# EasyEDA Pro project ProDoc_Esp32c3_2025-05-25.epro

# Board Esp32c3
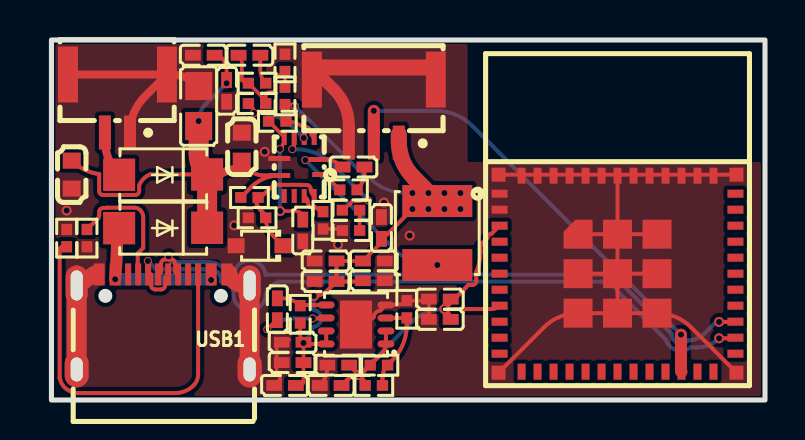
[diagram p0: board, top side]
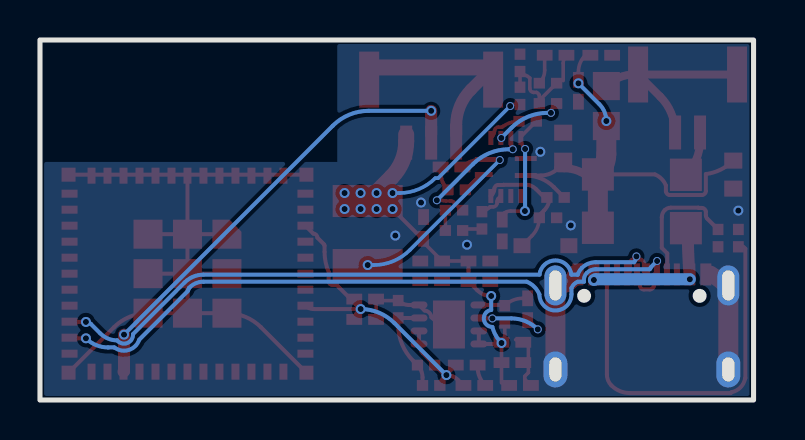
[diagram p1: board, bottom side, seen from below]

Outline 35.7 x 18 mm; copper layers: Top Layer, Bottom Layer. Coordinates in mm from the lower left corner of the outline.
Outline path: rectangle 0,18 35.7,0
Stack: Top Layer 0.035mm / Dielectric1 1.51mm FR4 er 4.5 / Bottom Layer 0.035mm

## Design rules (mm)
template: 自定义配置
spacing copperThickness1oz: track to track 0.102, other pairs 0.152 to 0.3
spacing copperThickness2oz (default): track to track 0.1, other pairs 0.1 to 0.3
track width copperThickness1oz: min 0.1, default 0.254, max 2.54
track width copperThickness2oz (default): min 0.1, default 0.254, max 2.54
differential pair differentialPair (default): width min 0.127, default 0.254, max 2.54; gap min 0.152, default 0.152
via viaSize (default): diameter min 0.5, default 0.61, max 10; hole min 0.3, default 0.305, max 6.3

## Placement (name value [footprint] x y rotation side)
C1  10uF  [C0603]  1.02 11.27 270 top
C2  22uF  [C0805]  7.37 14.7 90 top
C3  -  [C0402]  7.62 17.24 0 top
C3#2  -  [C0402]  8.76 15.46 270 top
C4  10uF  [C0603]  9.53 12.67 90 top
C5  1uF  [C0402]  12.57 8.48 90 top
C6  100nF  [C0402]  15.11 11.65 0 top
C7  100nF  [C0402]  9.91 17.24 0 top
C8  22uF  [C0402]  16.51 8.6 90 top
C9  22uF  [C0402]  13.72 6.95 0 top
C10  22uF  [C0402]  13.72 5.93 0 top
C11  22uF  [C0402]  16.13 6.95 0 top
C12  22uF  [C0402]  16.13 5.97 0 top
C13  1nF  [C0402]  11.3 4.54 90 top
C14  4.7uF  [C0402]  12.06 2.89 0 top
C15  2.2uF  [C0402]  12.06 1.87 0 top
C16  2.2uF  [C0402]  11.68 0.73 0 top
C17  4.7uF  [C0402]  19.43 5.05 0 top
C18  4.7uF  [C0402]  19.43 4.03 0 top
C19  100nF  [C0402]  13.97 0.73 0 top
C20  100nF  [C0402]  14.35 1.74 0 top
CN1  WAFER-GH1.25-2PWB  [CONN-TH_2P-P1.25_XUNPU_WAFER-GH1.25-2PWB]  3.3 14.83 180 top
CN3  WAFER-GH1.25-3PWB  [CONN-TH_3P-P1.25_GH1.25]  16.13 14.44 180 top
D1  SS34  [SMA_L4.3-W2.6-LS5.0-FD]  5.59 8.6 0 top
D2  SS34  [SMA_L4.3-W2.6-LS5.0-FD]  5.59 11.27 0 top
D3  BZT52C5V1S-7-F  [SOD-323_L1.8-W1.3-LS2.5-RD]  10.41 7.71 180 top
L1  15uH  [IND-SMD_L4.0-W4.0]  19.3 8.35 90 top
R1  5.1kΩ  [R0402]  0.76 8.09 90 top
R2  5.1kΩ  [R0402]  1.78 8.09 90 top
R3  -  [R0402]  9.91 10.13 0 top
R3#2  -  [R0402]  11.3 13.94 0 top
R4  20kΩ  [R0402]  10.29 9.11 0 top
R5  0Ω  [R0402]  14.86 10.51 0 top
R6  20kΩ  [R0402]  10.29 14.83 0 top
R7  41.2kΩ  [R0402]  10.29 15.84 0 top
R8  7.68kΩ  [R0402]  11.68 16.86 90 top
R9  10Ω  [R0402]  11.68 15.21 270 top
R10  10Ω  [R0402]  14.99 9.49 0 top
R11  76.8kΩ  [R0402]  14.99 8.48 0 top
R12  100kΩ  [R0402]  13.59 8.98 90 top
R13  100kΩ  [R0402]  12.45 4.28 90 top
R14  10kΩ  [R0402]  17.78 4.54 90 top
R15  62kΩ  [R0402]  16.38 1.74 0 top
R16  62kΩ  [R0402]  16.13 0.73 0 top
U1  MP4573GQBE-Z  [QFN-12_L3.0-W2.5-P0.5_MPQ4572]  12.45 11.65 180 top
U2  -  [TDFN-8_L3.0-W3.0-P0.65-BL-EP]  15.24 3.78 90 top
U2#2  -  [WIFIM-SMD_ESP32-C3-MINI-1]  28.32 6.32 0 top
USB1  TYPE-C 16PIN 2MD(073)  [USB-C-SMD_TYPE-C-6PIN-2MD-073]  5.59 3.9 0 top

## Footprints (pads in the part's own frame, mm; a bottom-side part is the same pattern mirrored in y, then rotated)
C0402
  rect 0.79x0.54 smd: 1(-0.545,0) 2(0.545,0)
C0603
  rect 0.8x0.9 smd: 1(-0.7,0) 2(0.7,0)
C0805
  rect 1.41x1.35 smd: 1(-1,0) 2(1,0)
CONN-TH_2P-P1.25_XUNPU_WAFER-GH1.25-2PWB
  rect 0.6x1.7 smd: 1(-0.625,1.45) 2(0.625,1.45)
  rect 1x2.8 smd: 3(-2.475,-1.45) 4(2.475,-1.45)
CONN-TH_3P-P1.25_GH1.25
  rect 0.6x1.7 smd: 1(-1.25,1.575) 2(0,1.575) 3(1.25,1.575)
  rect 1x2.8 smd: 4(3.1,-1.575) 5(-3.1,-1.575)
IND-SMD_L4.0-W4.0
  rect 1.6x3.5 smd: 1(-1.6,0) 2(1.6,0)
QFN-12_L3.0-W2.5-P0.5_MPQ4572
  rect 0.9x0.25 smd: 1(-1.05,0.375)
  rect 1.1x0.25 smd: 2(-0.95,-0.375) 7(1.05,-0.425) 8(1.05,0.425)
  rect 0.25x0.7 smd: 3(-0.7,-1.45) 4(-0.2,-1.45) 5(0.3,-1.45) 6(0.8,-1.45) 9(0.8,1.45) 10(0.3,1.45) 11(-0.2,1.45) 12(-0.7,1.45)
R0402
  rect 0.566x0.54 smd: 1(-0.433,0) 2(0.433,0)
SMA_L4.3-W2.6-LS5.0-FD
  rect 1.6x1.62 smd: 1(-2.201,-0.009) 2(2.201,0.009)
SOD-323_L1.8-W1.3-LS2.5-RD
  rect 0.85x0.75 smd: 1(-1.173,0) 2(1.173,0)
TDFN-8_L3.0-W3.0-P0.65-BL-EP
  oval 0.35x0.84 smd: 1(-0.975,-1.495) 2(-0.325,-1.495) 3(0.325,-1.495) 4(0.975,-1.495) 5(0.975,1.495) 6(0.325,1.495) 7(-0.325,1.495) 8(-0.975,1.495)
  rect 2.4x1.6 smd: 9(0,0)
USB-C-SMD_TYPE-C-6PIN-2MD-073
  rect 0.55x1.1 smd: 1(-3.2,2.375) 2(-2.4,2.375) 11(2.4,2.375) 12(3.2,2.375)
  rect 0.3x1.1 smd: 3(-1.75,2.375) 4(-1.25,2.375) 5(-0.75,2.375) 6(-0.25,2.375) 7(0.25,2.375) 8(0.75,2.375) 9(1.25,2.375) 10(1.75,2.375)
  oval 1.1x2 hole 0.6x1.5: 13(-4.325,1.825) 14(4.325,1.825)
  oval 1.2x1.8 hole 0.6x1.2: 13(-4.325,-2.375) 14(4.325,-2.375)
WIFIM-SMD_ESP32-C3-MINI-1
  rect 0.8x0.4 smd: 1(-5.9,4) 2(-5.9,3.2) 3(-5.9,2.4) 4(-5.9,1.6) 5(-5.9,0.8) 6(-5.9,0) 7(-5.9,-0.8) 8(-5.9,-1.6) 9(-5.9,-2.4) 10(-5.9,-3.2) 11(-5.9,-4) 25(5.9,-4) 26(5.9,-3.2) 27(5.9,-2.4) 28(5.9,-1.6) 29(5.9,-0.8) 30(5.9,0) 31(5.9,0.8) 32(5.9,1.6) 33(5.9,2.4) 34(5.9,3.2) 35(5.9,4)
  rect 0.4x0.8 smd: 12(-4.8,-4.9) 13(-4,-4.9) 14(-3.2,-4.9) 15(-2.4,-4.9) 16(-1.6,-4.9) 17(-0.8,-4.9) 18(0,-4.9) 19(0.8,-4.9) 20(1.6,-4.9) 21(2.4,-4.9) 22(3.2,-4.9) 23(4,-4.9) 24(4.8,-4.9) 36(4.8,4.9) 37(4,4.9) 38(3.2,4.9) 39(2.4,4.9) 40(1.6,4.9) 41(0.8,4.9) 42(0,4.9) 43(-0.8,4.9) 44(-1.6,4.9) 45(-2.4,4.9) 46(-3.2,4.9) 47(-4,4.9) 48(-4.8,4.9)
  custom 1.45x1.45 smd: 49(-1.975,1.975)
  rect 1.45x1.45 smd: 49(-1.975,0) 49(-1.975,-1.975) 49(0,1.975) 49(0,0) 49(0,-1.975) 49(1.975,1.975) 49(1.975,0) 49(1.975,-1.975)
  rect 0.7x0.7 smd: 50(5.95,4.95) 51(5.95,-4.95) 52(-5.95,-4.95) 53(-5.95,4.95)

## Nets
GND: C1.2 C2.2 C3.1 C3#2.2 C4.2 C5.1 C8.2 C9.1 C10.1 C11.2 C12.2 C14.1 C15.1 C16.1 C17.1 C18.1 C19.1 C20.1 CN1.1 CN1.3 CN1.4 CN3.3 CN3.4 CN3.5 D3.2 R1.2 R2.1 R4.1 R8.2 R11.1 R12.1 R14.2 U1.7 U2.4 U2.9 U2#2.1 U2#2.2 U2#2.36 U2#2.37 U2#2.38 U2#2.39 U2#2.40 U2#2.41 U2#2.42 U2#2.43 U2#2.44 U2#2.45 U2#2.46 U2#2.47 U2#2.48 U2#2.49 U2#2.50 U2#2.51 U2#2.52 U2#2.53 USB1.1 USB1.12 USB1.13 USB1.14
VCC: CN1.2 D1.1 D2.1 USB1.2 USB1.11
VCC-M: C5.2 R3#2.1 U1.6
VIN-DC: C1.1 C2.1 C3.2 C3#2.1 C4.1 D1.2 D2.2 R3.1 U1.8
0: C6.2 R5.2
1: C7.1 R6.2 R7.1 R8.1 R9.1
2: C7.2 R7.2
BST: R5.1 U1.1
CC1: R2.2 USB1.4
CC2: R1.1 USB1.10
CCM: R12.2 U1.11
DATA+: U2#2.27 USB1.6 USB1.8
DATA-: U2#2.26 USB1.5 USB1.7
EN: D3.1 R3.2 R4.2 U1.12
EN1: C13.2 R13.2 U2.5
FB: R6.1 U1.4
FB1: R14.1 R15.2 R16.2 U2.3
FREQ: R10.1 U1.5
LC: CN3.2 U2#2.22
NC1: C13.1 U2.6
OUT: C17.2 C18.2 C19.2 C20.2 R15.1 R16.1 U2.1 U2.2 U2#2.3 U2#2.8
PG: R3#2.2 U1.3
SW: C6.1 L1.1 U1.2
SWCLK: USB1.9
SWDIO: USB1.3
VOUT-5V: C8.1 C9.2 C10.2 C11.1 C12.1 C14.2 C15.2 C16.2 CN3.1 L1.2 R9.2 R13.1 U2.7 U2.8

Pads without a net: R10 2; R11 2; U1 9 10; U2#2 4 5 6 7 9 10 11 12 13 14 15 16 17 18 19 20 21 23 24 25 28 29 30 31 32 33 34 35

## Via types
v1: diameter 0.5, hole 0.305, Top Layer to Bottom Layer, 26 vias
v2: diameter 0.4, hole 0.305, Top Layer to Bottom Layer, 13 vias

## Routing (per net, layer and track width the routed paths; a pad name or vN(x,y) marks a point on that pad's centre or on a via; arc(x,y) is an arc through that point)
GND: length 81.9
  Top Layer w0.18: C16.1 11.45,1.04 11.45,1.19 11.27,1.37 11.27,2.69 11.59,3.01 11.9,3.01 ; 13.72,8.55 14.37,8.55 arc(14.47,8.53) R11.1 ; C18.1 C17.1 arc(18.8,4.99) 18.7,4.97 R14.2
  Top Layer w0.2: U2#2.49 U2#2.49 ; U2#2.49 U2#2.49 ; U2#2.49 U2#2.49 ; U2#2.49 U2#2.42 ; U2#2.53 U2#2.50 ; C20.1 13.81,1.65 arc(13.71,1.15) C19.1 ; U2#2.51 32,3.63 arc(31.22,4.16) U2#2.49 U2#2.49 ; U2#2.49 U2#2.49 ; U2#2.49 U2#2.49 ; U2#2.49 U2#2.49 ; U2#2.52 24.64,3.63 arc(25.42,4.16) U2#2.49 U2#2.49 ; R14.2 arc(17.54,4.81) 17.25,4.75 U2.4 16.46,4.48 arc(16.23,4.37) 16.12,4.13 arc(15.71,3.87) U2.9
  Top Layer w0.4: CN1.3 5.97,16.28 arc(6.73,16.12) C2.2 ; CN1.3 CN1.4 ; CN1.3 4.67,15.17 arc(4.12,14.35) CN1.1
  Top Layer w0.6: 14.88,13.28 14.88,13.73 arc(14.69,14.7) 14.13,15.52 13.03,16.63
  Top Layer w0.8: 13.03,16.63 19.23,16.63 ; 9.66,5.73 arc(9.17,5.9) 8.9,6.35 ; 2.16,6.32 arc(1.69,5.98) 1.26,5.6
  Top Layer w1: 1.26,5.6 1.26,1.4 ; 9.91,5.6 9.91,1.4
  vias: v1(0.76,9.47) v1(9.14,8.73) v1(10.67,12.41) v1(14.34,7.76) v1(16.64,9.87) v1(17.92,8.22)
VCC: length 10.1
  Top Layer w0.4: CN1.2 2.68,12.97 arc(2.86,12.05) D2.1
  Top Layer w0.6: v2(3.19,6.04) arc(3.28,7.5) 3.28,8.97
  Bottom Layer w0.6: v2(3.19,6.04) 7.9,6.04 arc(7.95,6.03) v2(7.99,6)
VCC-M: length 6
  Top Layer w0.18: R3#2.1 11.6,13.2 arc(11.63,13.16) U1.6 11.65,13.07 arc(11.59,12.79) v2(11.43,12.55) ; v1(11.44,9.45) 12.15,9.45 arc(12.38,9.4) 12.57,9.27
  Bottom Layer w0.2: v2(11.43,12.55) 11.43,9.47 arc(11.43,9.46) v1(11.44,9.45)
VIN-DC: length 23.3
  Top Layer w0.18: C3#2.1 8.76,16.41 arc(8.67,16.86) 8.42,17.24
  Top Layer w0.2: R3.1 9.99,10.64 arc(10.63,11.07) U1.8 10.65,11.23 arc(10.18,11.32) 9.78,11.59 ; D2.2 4.93,11.28 arc(4.61,11.06) 4.39,10.73 4.39,10.45 arc(4.33,10.31) 4.19,10.25 2.59,10.25 arc(2.45,10.31) 2.39,10.45 2.39,11.3 arc(1.65,11.52) C1.1
  Top Layer w0.4: 9.78,11.59 9.47,11.59 arc(8.74,11.44) 8.13,11.03
  Top Layer w1: C2.1 7.37,12.3 arc(7.48,11.75) D2.2 D1.2
  Bottom Layer w0.2: v1(8.76,15.84) 7.71,14.78 arc(7.46,14.4) v1(7.37,13.95)
(no net): length 1
  Top Layer w0.18: R10.2 R11.2
0: length 1.1
  Top Layer w0.2: 15.66,11.52 15.66,11.39 arc(15.56,10.91) R5.2
1: length 5.6
  Top Layer w0.18: 11.68,16.3 11.68,16.3 arc(11.42,16.24) 11.19,16.09 11.19,15.57 arc(11.14,15.44) 11,15.38 10.86,15.38 arc(10.78,15.32) 10.72,15.24 R6.2 arc(10.69,14.96) 10.61,15.08 R7.1 ; 11.68,16.3 R9.1 ; 11.68,16.3 11.68,16.42 ; 9.53,15.97 9.53,16.84 arc(9.48,17.06) C7.1
2: length 1.5
  Top Layer w0.18: C7.2 10.45,16.49 arc(10.52,16.14) R7.2
BST: length 1.2
  Top Layer w0.18: R5.1 13.77,11.16 arc(13.65,11.25) U1.1
CC1: length 6.7
  Top Layer w0.2: R2.2 2.32,9.06 arc(2.37,9.14) 2.39,9.24 2.39,9.4 arc(2.45,9.54) 2.59,9.6 2.73,9.6 arc(2.75,9.61) 2.77,9.62 4.14,9.62 arc(4.3,9.59) 4.44,9.49 arc(4.55,9.33) 4.59,9.14 4.59,7.61 4.32,7.33 4.32,6.33 arc(4.32,6.3) USB1.4
CC2: length 19.4
  Top Layer w0.2: USB1.10 7.34,1.27 arc(7.28,0.98) 7.11,0.73 arc(6.69,0.45) 6.19,0.35 1.14,0.35 1.1,0.39 arc(0.66,0.63) 0.43,1.06 arc(0.42,1.08) 0.41,1.1 0.41,7.56 0.51,7.66
CCM: length 1.5
  Top Layer w0.18: U1.11 12.77,10.07 arc(12.82,10.01) 12.83,9.93 12.83,9.85 arc(12.89,9.72) 13.02,9.66 13.16,9.66 arc(13.18,9.65) 13.21,9.64 13.23,9.62 arc(13.45,9.47) 13.72,9.42
DATA+: length 33.6
  Top Layer w0.2: v1(33.4,3.9) 34.19,3.9 arc(34.21,3.91) 34.22,3.92 ; USB1.6 arc(5.43,6.34) 5.49,6.43 5.49,6.83 arc(5.55,6.97) 5.69,7.03 5.99,7.03 arc(6.13,6.97) 6.19,6.83 6.19,6.43 arc(6.25,6.34) USB1.8
  Bottom Layer w0.2: v2(5.86,7.18) arc(5.89,7.02) 5.98,6.89 7.9,6.89 arc(8.27,6.81) 8.59,6.6 arc(8.71,6.45) 8.8,6.27 9.12,6.27 arc(9.91,6.98) 10.71,6.27 27.52,6.27 arc(28.03,6.17) 28.46,5.88 31.05,3.29 arc(31.33,2.85) 31.84,2.98 arc(32.3,3.07) 32.68,3.33 33.15,3.8 arc(33.27,3.88) v1(33.4,3.9)
DATA-: length 36.2
  Top Layer w0.2: v1(33.4,3.09) 34.15,3.09 arc(34.19,3.09) U2#2.26 ; USB1.7 5.81,6.28 arc(5.75,6.18) 5.69,6.1 5.69,5.73 arc(5.63,5.59) 5.49,5.53 5.19,5.53 arc(5.05,5.59) 4.99,5.73 4.99,6.24 arc(4.99,6.26) 4.99,6.28 USB1.5 4.84,6.92 arc(4.83,6.94) v2(4.83,6.95)
  Bottom Layer w0.2: v2(4.83,6.95) 5.14,6.64 arc(5.16,6.61) 5.17,6.57 arc(5.18,6.55) 5.2,6.54 7.9,6.54 arc(8.14,6.49) 8.34,6.35 arc(8.46,6.15) 8.48,5.92 8.79,5.92 arc(8.98,5.79) 9.11,5.6 9.11,5.28 arc(9.91,4.48) 10.72,5.28 arc(10.97,5.66) 11.35,5.92 27.52,5.92 arc(27.9,5.84) 28.21,5.63 28.25,5.6 arc(28.27,5.56) 28.28,5.52 arc(28.29,5.47) 28.31,5.44 30.74,3.01 arc(31.26,2.5) 31.98,2.63 32.3,2.63 arc(32.9,2.75) v1(33.4,3.09)
EN: length 6.4
  Top Layer w0.18: D3.1 11.09,8.21 arc(10.82,8.62) R4.2
  Top Layer w0.2: 10.85,9.11 10.48,9.48 arc(10.28,9.77) 10.21,10.13 ; 10.34,10 10.88,10.54 arc(11.14,10.71) 11.44,10.77 11.46,10.76 12.51,10.76 12.52,10.75 12.77,10.75 arc(12.91,10.69) 12.97,10.55 arc(13,10.39) 13.09,10.25 U1.12
EN1: length 2.5
  Top Layer w0.18: C13.2 11.56,5.08 arc(12.04,4.99) R13.2
  Top Layer w0.2: U2.5 12.53,4.75 arc(12.48,4.74) R13.2
FB: length 3.5
  Top Layer w0.18: R6.1 10.01,14.67 arc(10.1,14.53) v2(10.14,14.36)
  Bottom Layer w0.2: v2(12.62,13.1) 12.11,13.61 arc(11.29,14.16) 10.31,14.36 v2(10.14,14.36)
FB1: length 4.8
  Top Layer w0.2: 16.56,0.73 16.56,1.13 arc(16.63,1.46) R15.2 17.04,1.96 arc(17.59,2.79) 17.78,3.76 R14.1 arc(17.78,4.1) 17.77,4.1 U2.3
FREQ: length 6.8
  Top Layer w0.18: v2(15.85,9.99) 15.75,9.99 arc(15.58,9.98) 15.41,9.95 15.14,9.95 arc(15.01,9.9) 14.95,9.78 arc(14.74,9.65) R10.1 ; U1.5 12.15,12.77 arc(12.12,12.64) v2(12.05,12.54)
  Bottom Layer w0.2: v2(12.05,12.54) 12.24,12.54 arc(13.22,12.34) 14.04,11.79 v2(15.85,9.99)
LC: length 22.9
  Top Layer w0.6: 31.52,1.42 31.5,1.44 v1(31.5,3.27) ; 16.13,13.28 v1(16.13,14.46)
  Bottom Layer w0.2: v1(16.13,14.46) 19.25,14.46 arc(20.23,14.27) 21.05,13.71 v1(31.5,3.27)
NC1: length 3.8
  Top Layer w0.18: v2(10.79,3.53) 11.22,3.96 arc(11.26,3.98) C13.1
  Top Layer w0.2: v2(13.07,4.08) 13.69,4.08 arc(13.72,4.09) U2.6
  Bottom Layer w0.2: v2(13.07,4.08) 12.12,4.08 arc(11.4,3.94) v2(10.79,3.53)
OUT: length 19.9
  Top Layer w0.2: 19.85,4.74 v1(19.66,4.55) ; 19.85,4.74 20.72,5.61 arc(20.78,5.68) 20.85,5.75 21.05,5.75 arc(21.2,5.81) 21.25,5.95 21.25,6.4 arc(21.41,6.89) 21.46,7.41 21.46,7.71 arc(21.47,7.75) 21.5,7.79 21.82,8.12 arc(21.88,8.26) 22.02,8.32 U2#2.3 ; 19.85,4.74 arc(19.94,4.88) C17.2 ; v1(19.66,4.55) 22.01,4.55 arc(22.23,4.59) U2#2.8 ; v1(19.66,4.55) 19.84,4.37 arc(19.94,4.21) C18.2 ; v1(15.37,1.25) 15.56,1.05 arc(15.66,0.9) R16.1 ; v1(15.37,1.25) arc(15.36,1.27) 15.35,1.29 C20.2 ; v1(15.37,1.25) arc(15.45,1.26) 15.51,1.31 R15.1 16.54,2.34 arc(16.68,2.55) U2.1 U2.2 ; v1(15.37,1.25) arc(15.06,1.18) 14.8,1.01 C19.2
  Bottom Layer w0.2: v1(15.37,1.25) 17.97,3.85 arc(18.74,4.37) v1(19.66,4.55)
PG: length 1.8
  Top Layer w0.18: U1.3 13.08,13.17 arc(12.99,13.3) 12.96,13.45 arc(12.91,13.58) 12.77,13.64 12.59,13.64 arc(12.19,13.86) R3#2.2
SW: length 10.6
  Top Layer w0.18: v2(12.7,12) 13.33,12 arc(13.37,12) U1.2 13.66,12.03 arc(14.15,11.93) C6.1
  Bottom Layer w0.18: v1(19.3,6.75) 19,6.75 arc(18.03,6.94) 17.2,7.49 v2(12.7,12)
VOUT-5V: length 28.6
  Top Layer w0.18: R13.1 12.45,3.28 arc(12.49,3.07) C14.2 v1(12.61,2.85) C15.2 12.61,0.86 ; C9.2 C11.1 16.38,7.75 arc(16.48,7.89) C8.1 ; R9.2 12.14,14.77 arc(12.18,14.75) v2(12.18,14.7)
  Top Layer w0.2: C9.2 C10.2 ; C10.2 15.49,5.93 arc(15.54,5.94) C12.1 ; C10.2 13.83,5.49 arc(13.51,5.28) v1(13.13,5.2) ; U2.7 U2.8 12.82,2.8 arc(12.71,2.82) C14.2 ; v1(18.06,9.55) 16.61,8.1 arc(16.57,8.07) C8.1
  Top Layer w0.8: 17.38,13.28 17.38,12.93 arc(17.57,11.95) 18.12,11.13 19.3,9.95
  Bottom Layer w0.18: v2(12.18,14.7) 15.78,11.09 15.93,11.09 arc(16.75,10.54) 17.72,10.35 v1(18.06,10.35)
  Bottom Layer w0.2: v1(13.13,5.2) 13.13,4.5 arc(13.49,4.05) 13.07,3.65 arc(12.89,3.22) v1(12.61,2.85)
  vias: v1(18.86,10.35) v1(18.86,9.55) v1(19.66,10.35) v1(19.66,9.55) v1(20.46,10.35) v1(20.46,9.55)

## Copper pours and planes (outline as drawn; the poured copper is in the pictures)
GND on Top Layer: -0.51,18.25 35.92,18.25 35.92,0 -0.51,0
GND on Bottom Layer: -0.51,18.25 35.81,18.25 35.81,-0.16 -0.51,-0.16
